# Altium schematic sheet Battery Charger.SchDoc
size 297 x 210 mm
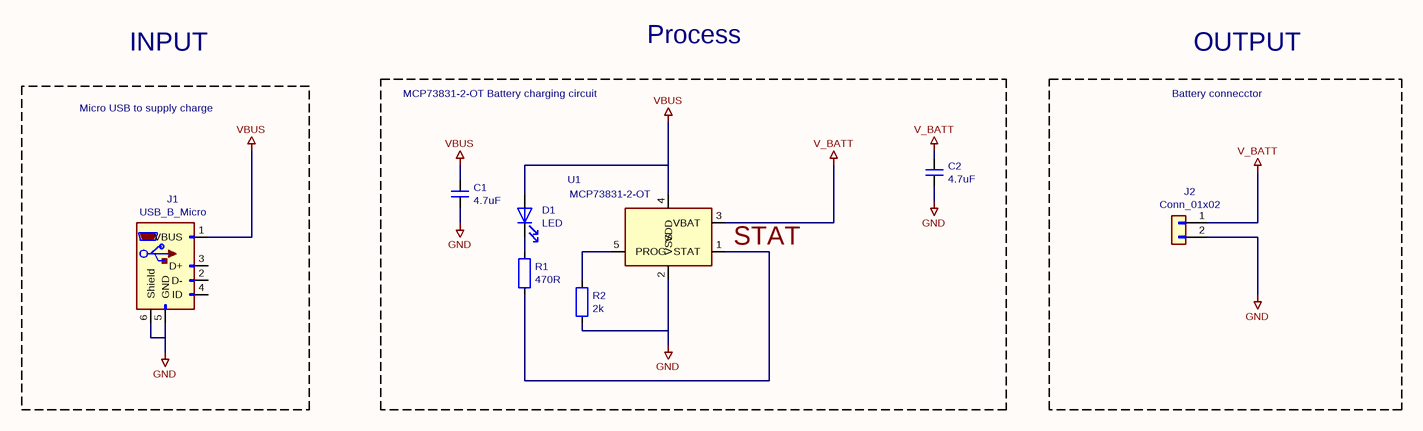
[diagram p0: Battery Charger.SchDoc]

## Parts
C1  4.7uF  [C_1206_3216Metric_Pad1.42x1.75mm_HandSolder]
C2  4.7uF  [C_1206_3216Metric_Pad1.42x1.75mm_HandSolder]
D1  LED  [LED_1206_3216Metric_Pad1.42x1.75mm_HandSolder]
J1  USB_B_Micro  [USB_Micro-B_Molex-105017-0001]
J2  Conn_01x02  [JST_GH_SM02B-GHS-TB_1x02-1MP_P1.25mm_Horizontal]
R1  470R  [R_1206_3216Metric_Pad1.42x1.75mm_HandSolder]
R2  2k  [R_1206_3216Metric_Pad1.42x1.75mm_HandSolder]
U1  MCP73831-2-OT  [SOT-23-5]

## Blocks framed on the sheet
Micro USB to supply charge: J1
MCP73831-2-OT Battery charging circuit: C1 C2 D1 R1 R2 U1
Battery connecctor: J2

## Nets
GND: C1.2 C2.2 J1.5(GND) J1.6(Shield) J2.2(Pin_2) R2.2 U1.2(VSS)
V_BATT: C2.1 J2.1(Pin_1) U1.3(VBAT)
VBUS: C1.1 D1.2(A) J1.1(VBUS) U1.4(VDD)
STAT: R1.2 U1.1(STAT)
NetD1_1: D1.1(K) R1.1
NetR2_1: R2.1 U1.5(PROG)

Not connected (* = marked no-connect by the designer): J1 2(D-) 3(D+) 4(ID)

## Notes on the sheet
- INPUT
- Process
- OUTPUT
- 1
- 2
- 3
- 4
- 5
- 6
- A
- B
- C
- D
- Title: Battery Charger
- File: Battery Charger.sch
- Sheet: /
- PlumPot
- KiCad E.D.A.  kicad (5.1.4)-1
- Size: A4
- Date: 2020-08-30
- Rev: HR1.00
- Id: 1/1

## Library data of the parts
C1 C2 = C_Small: Value: 4.7uF; Footprint: Capacitor_SMD:C_1206_3216Metric_Pad1.42x1.75mm_HandSolder
R1 R2 = R: Footprint: Resistor_SMD:R_1206_3216Metric_Pad1.42x1.75mm_HandSolder
  R1: Value: 470R
  R2: Value: 2k
D1 = LED: Value: LED; Footprint: LED_SMD:LED_1206_3216Metric_Pad1.42x1.75mm_HandSolder
J1 = USB_B_Micro: Value: USB_B_Micro; Footprint: Connector_USB:USB_Micro-B_Molex-105017-0001
J2 = Conn_01x02: Value: Conn_01x02; Footprint: Connector_JST:JST_GH_SM02B-GHS-TB_1x02-1MP_P1.25mm_Horizontal
U1 = MCP73831-2-OT: Value: MCP73831-2-OT; Footprint: Package_TO_SOT_SMD:SOT-23-5